# Altium schematic sheet Current_Measurement.SchDoc
size A4
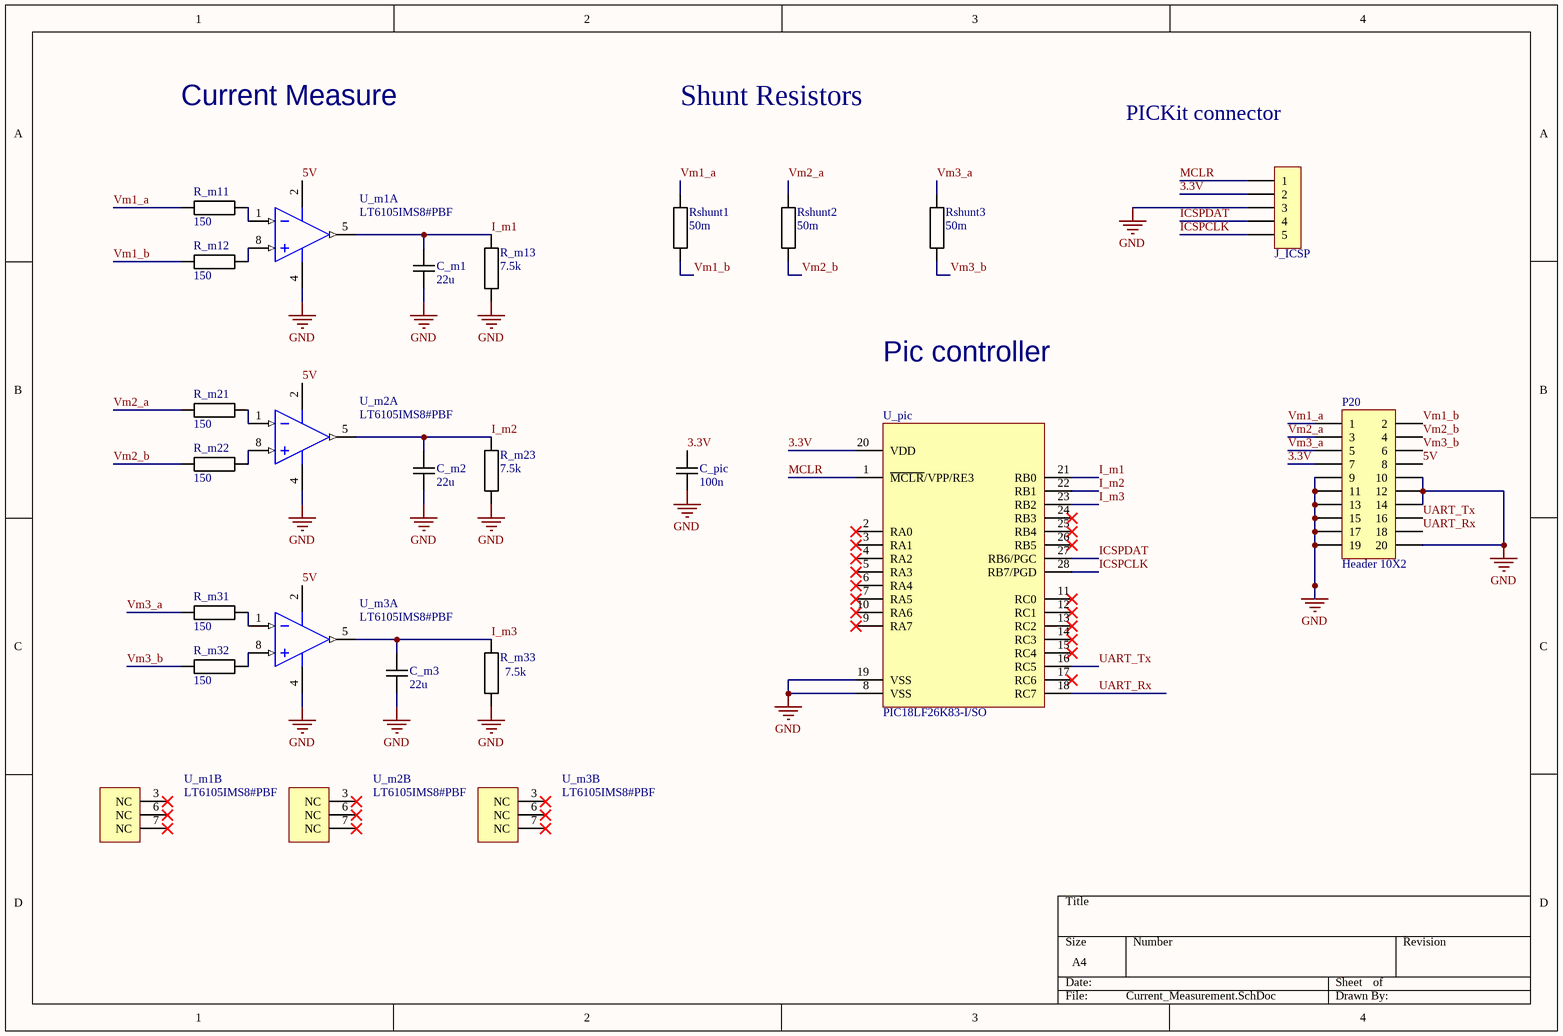
[diagram p0: Current_Measurement.SchDoc]

## Parts
C_m1  22u  [RESC3115X65N]
C_m2  22u  [RESC3115X65N]
C_m3  22u  [RESC3115X65N]
C_pic  100n  [RESC3115X65N]
J_ICSP  *  [HDR1X5]  (value not drawn)
P20  Header 10X2  [HDR2X10]
R_m11  150  [RESC3115X65N]
R_m12  150  [RESC3115X65N]
R_m13  7.5k  [RESC3115X65N]
R_m21  150  [RESC3115X65N]
R_m22  150  [RESC3115X65N]
R_m23  7.5k  [RESC3115X65N]
R_m31  150  [RESC3115X65N]
R_m32  150  [RESC3115X65N]
R_m33  7.5k  [RESC3115X65N]
Rshunt1  50m  [RESC3115X65N]
Rshunt2  50m  [RESC3115X65N]
Rshunt3  50m  [RESC3115X65N]
U_m1  LT6105IMS8#PBF  [LT-MS8-8_L]  (parts A,B of 2)
U_m2  LT6105IMS8#PBF  [LT-MS8-8_L]  (parts A,B of 2)
U_m3  LT6105IMS8#PBF  [LT-MS8-8_L]  (parts A,B of 2)
U_pic  PIC18LF26K83-I/SO  [SOIC127P1030X265-28N]

## Nets
GND: C_m1.1 C_m2.1 C_m3.1 C_pic.1 J_ICSP.3 P20.9 P20.10 P20.11 P20.12 P20.13 P20.14 P20.15 P20.17 P20.19 P20.20 R_m13.1 R_m23.1 R_m33.1 U_m1.4(V-) U_m2.4(V-) U_m3.4(V-) U_pic.8(VSS) U_pic.19(VSS)
3.3V: C_pic.2 J_ICSP.2 P20.7 U_pic.20(VDD)
5V: P20.8 U_m1.2(V+) U_m2.2(V+) U_m3.2(V+)
I_m1: C_m1.2 R_m13.2 U_m1.5(VOUT) U_pic.21(RB0)
I_m2: C_m2.2 R_m23.2 U_m2.5(VOUT) U_pic.22(RB1)
I_m3: C_m3.2 R_m33.2 U_m3.5(VOUT) U_pic.23(RB2)
ICSPCLK: J_ICSP.5 U_pic.28(RB7/PGD)
ICSPDAT: J_ICSP.4 U_pic.27(RB6/PGC)
MCLR: J_ICSP.1 U_pic.1(~{MCLR}/VPP/RE3)
UART_Rx: P20.18 U_pic.18(RC7)
UART_Tx: P20.16 U_pic.16(RC5)
Vm1_a: P20.1 R_m11.1 Rshunt1.2
Vm1_b: P20.2 R_m12.1 Rshunt1.1
Vm2_a: P20.3 R_m21.1 Rshunt2.2
Vm2_b: P20.4 R_m22.1 Rshunt2.1
Vm3_a: P20.5 R_m31.1 Rshunt3.2
Vm3_b: P20.6 R_m32.1 Rshunt3.1
NetR_m11_2: R_m11.2 U_m1.1(-IN)
NetR_m12_2: R_m12.2 U_m1.8(+IN)
NetR_m21_2: R_m21.2 U_m2.1(-IN)
NetR_m22_2: R_m22.2 U_m2.8(+IN)
NetR_m31_2: R_m31.2 U_m3.1(-IN)
NetR_m32_2: R_m32.2 U_m3.8(+IN)

Not connected (* = marked no-connect by the designer): U_m1 3(NC)* 6(NC)* 7(NC)*; U_m2 3(NC)* 6(NC)* 7(NC)*; U_m3 3(NC)* 6(NC)* 7(NC)*; U_pic 2(RA0)* 3(RA1)* 4(RA2)* 5(RA3)* 6(RA4)* 7(RA5)* 9(RA7)* 10(RA6)* 11(RC0)* 12(RC1)* 13(RC2)* 14(RC3)* 15(RC4)* 17(RC6)* 24(RB3)* 25(RB4)* 26(RB5)*

## Notes on the sheet
- Current Measure
- Shunt Resistors
- PICKit connector
- Pic controller

## Library data of the parts
C_m1-C_m3 C_pic = Capacitor
  C_m1-C_m3: Value: 22u
  C_pic: Value: 100n
J_ICSP = PinHeader1x5: Plug connector; Value: *
P20 = Header 10X2: Header, 10-Pin, Dual row; LatestRevisionDate: 17-Jul-2002; LatestRevisionNote: Re-released for DXP Platform.; Publisher: Altium Limited
R_m11-R_m13 R_m21-R_m23 R_m31-R_m33 Rshunt1-Rshunt3 = Resistor
  R_m11 R_m12 R_m21 R_m22 R_m31 R_m32: Value: 150
  R_m13 R_m23 R_m33: Value: 7.5k
  Rshunt1-Rshunt3: Value: 50m
U_m1-U_m3 = LT6105IMS8#PBF: Single Channel, Precision, Rail-to-Rail Input Current Sense Amplifier, 0.1 MHz Typical GBW, 2.85 to 36 V, 8-Pin SOP (MS8-8), Industrial, Pb-Free; Linear Technology Part Number: LT6105; Manufacturer: Linear Technology; Vs Max (V): 36; Vos (mV) Guaranteed: 0.3; Channels (#): 1; Vs Min (V): 2.85; Vos (mV) Typical: 0.1; Is (mA) Typical: 0.2; PartNumber: LT6105IMS8#PBF; Type: CSA; PackageVersion: Rev G; ComponentLink1Description: Manufacturer URL; ComponentLink2Description: Datasheet; DatasheetVersion: Rev. A; ComponentLink3URL: http://cds.linear.com/docs/en/packaging/05081610_G_SO8.pdf; ComponentLink1URL: http://www.linear.com/; RevisionNote: URLs updated; ComponentLink2URL: http://cds.linear.com/docs/en/datasheet/6105fa.pdf; ComponentLink3Description: Package Specification; RoHS: Pb-Free; Mounting Technology: Surface Mount; PackageReference: LT-MS8-8; PackageDescription: 8-Lead Plastic Small Outline, Body 3.9 x 4.9 mm, Pitch 1.27 mm; GBW (MHz) Typical: 0.1
U_pic = PIC18F26K83-_/SO: Flash Microcontrollers  with 10-Bit A/D and nanoWatt Technology; Value: PIC18LF26K83-I/SO